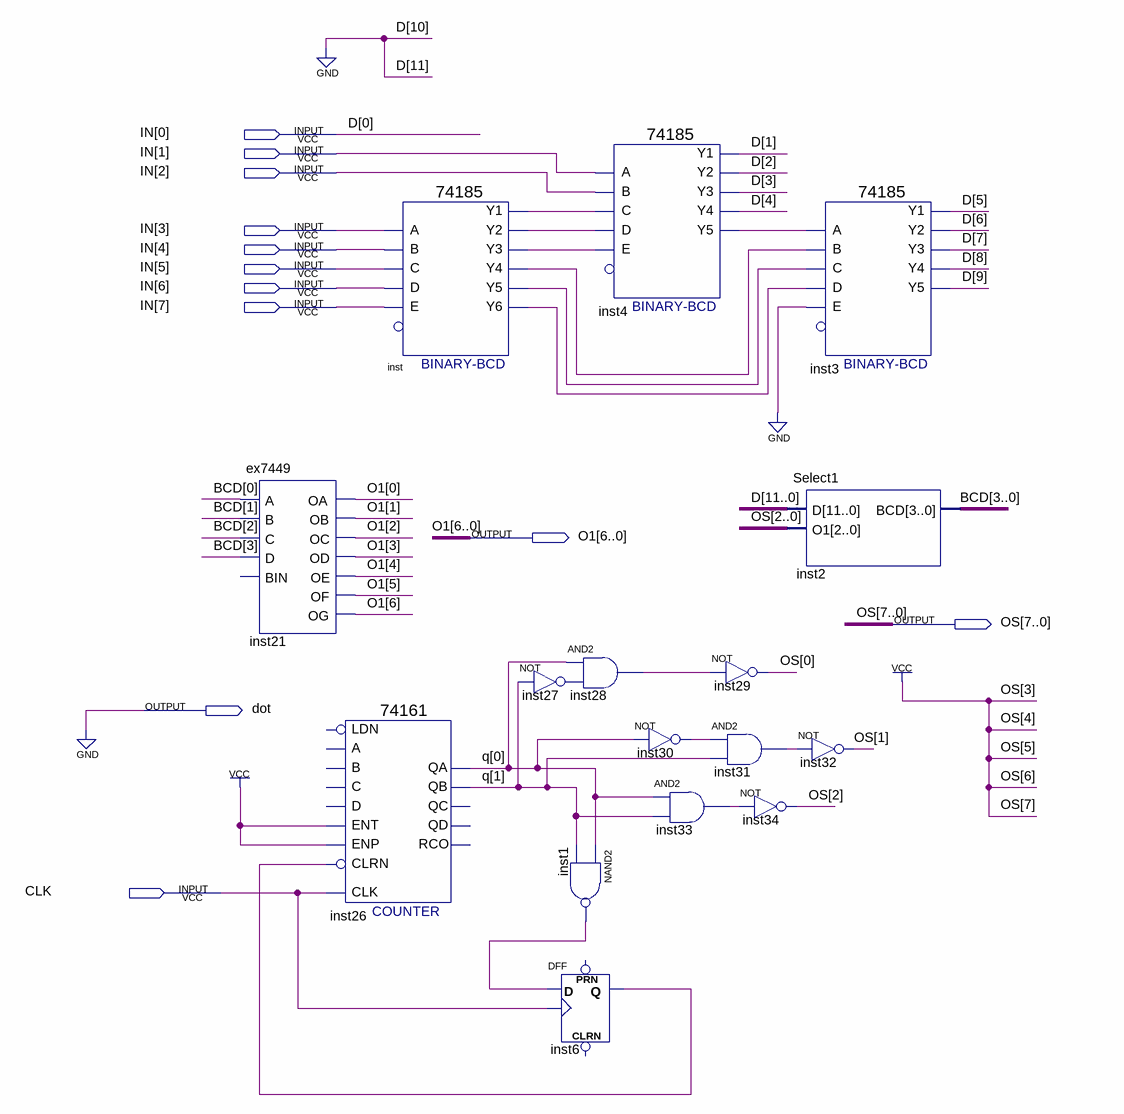
[diagram p0: schematic sheet]
// Quartus schematic tube.bdf as structural Verilog: 16 symbols, 12 pins
module tube (
  input  [7:0] IN,
  input  CLK,
  output [6:0] O1,
  output [7:0] OS,
  output dot
);

  wire inst1_out, inst4_y5, inst6_q, inst27_out, inst28_out, inst30_out, inst31_out, inst33_out, inst_y1,
       inst_y2, inst_y3, inst_y4, inst_y5, inst_y6;
  wire [1:0] q;
  wire [3:0] BCD;
  wire [9:1] D;

  ex7449 inst21 (
    .A(BCD[0]), .B(BCD[1]), .C(BCD[2]), .D(BCD[3]), .OA(O1[0]), .OB(O1[1]), .OC(O1[2]), .OD(O1[3]),
    .OE(O1[4]), .OF(O1[5]), .OG(O1[6]));  // open: BIN
  \74161  inst26 (
    .CLRN(inst6_q), .CLK(CLK), .ENP(1'b1), .ENT(1'b1), .QB(q[1]), .QA(q[0]));  // open: LDN, A, D, B, C, QD, QC, RCO
  \74185  inst (
    .A(IN[3]), .B(IN[4]), .D(IN[6]), .C(IN[5]), .E(IN[7]), .Y1(inst_y1), .Y3(inst_y3), .Y2(inst_y2),
    .Y5(inst_y5), .Y4(inst_y4), .Y6(inst_y6));
  not inst27 (inst27_out, q[1]);
  \74185  inst4 (
    .A(IN[1]), .B(IN[2]), .D(inst_y2), .C(inst_y1), .E(inst_y3), .Y1(D[1]), .Y3(D[3]), .Y2(D[2]),
    .Y5(inst4_y5), .Y4(D[4]));
  and inst28 (inst28_out, q[0], inst27_out);
  nand inst1 (inst1_out, q[0], q[1]);
  DFF inst6 (.CLK(CLK), .D(inst1_out), .Q(inst6_q));  // open: CLRN, PRN
  not inst30 (inst30_out, q[0]);
  and inst33 (inst33_out, q[0], q[1]);
  not inst29 (OS[0], inst28_out);
  and inst31 (inst31_out, inst30_out, q[1]);
  not inst34 (OS[2], inst33_out);
  \74185  inst3 (
    .A(inst4_y5), .B(inst_y4), .D(inst_y6), .C(inst_y5), .E(1'b0), .Y1(D[5]), .Y3(D[7]), .Y2(D[6]),
    .Y5(D[9]), .Y4(D[8]));
  Select1 inst2 (.D({2'b00, D, IN[0]}), .O1(OS[2:0]), .BCD(BCD));
  not inst32 (OS[1], inst31_out);

  assign dot = 1'b0;
  assign OS[7:3] = {5{1'b1}};

  // Other names for the same wires on the sheet: D[0] = IN[0]
endmodule
